# Altium schematic sheet CLK_buffer.SchDoc: Mordovia_MCH_CLK
size A4; Author: Filip Świtakowski; DrawnBy: Filip Świtakowski; DocumentNumber: 2; Revision: 1.0; SheetNumber: 2; SheetTotal: 4; ModifiedBy: -; CheckedDate: -; Title2: CLK_buffer; DivGrp: WUT ISE; Designer: Filip Świtakowski
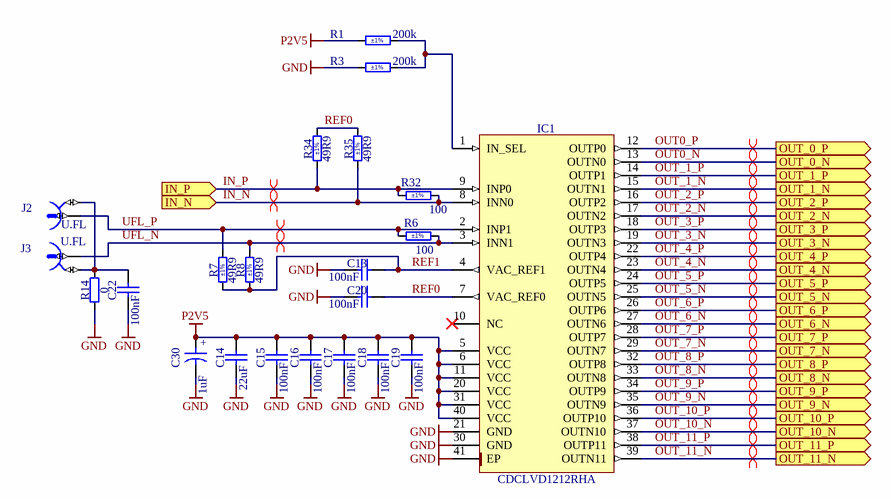
[diagram p0: CLK_buffer.SchDoc]

## Parts
C13  100nF  [CAPC1005X55N]
C14  22uF  [CAPC2012X135N]
C15  100nF  [CAPC1005X55N]
C16  100nF  [CAPC1005X55N]
C17  100nF  [CAPC1005X55N]
C18  100nF  [CAPC1005X55N]
C19  100nF  [CAPC1005X55N]
C20  100nF  [CAPC1005X55N]
C22  100nF  [CAPC1005X55N]
C30  1uF  [CAPMP3216X180N]
IC1  CDCLVD1212RHA  [QFN50P600X600X100-41N-S425]
J2  U.FL  [HIROSE_U.FL-R-SMT-1(10)]
J3  U.FL  [HIROSE_U.FL-R-SMT-1(10)]
R1  200k  Tolerance: ±1%  [RESC1005X40N]
R3  200k  Tolerance: ±1%  [RESC1005X40N]
R6  100  Tolerance: ±1%  [RESC1005X40N]
R7  49R9  Tolerance: ±1%  [RESC1005X40N]
R8  49R9  Tolerance: ±1%  [RESC1005X40N]
R14  0  [RESC1005X40N]
R32  100  Tolerance: ±1%  [RESC1005X40N]
R34  49R9  Tolerance: ±1%  [RESC1005X40N]
R35  49R9  Tolerance: ±1%  [RESC1005X40N]

## Ports
IN_N (in), IN_P (in), OUT_0_N (out), OUT_0_P (out), OUT_1_N (out), OUT_1_P (out), OUT_2_N (out), OUT_2_P (out), OUT_3_N (out), OUT_3_P (out), OUT_4_N (out), OUT_4_P (out), OUT_5_N (out), OUT_5_P (out), OUT_6_N (out), OUT_6_P (out), OUT_7_N (out), OUT_7_P (out), OUT_8_N (out), OUT_8_P (out), OUT_9_N (out), OUT_9_P (out), OUT_10_N (out), OUT_10_P (out), OUT_11_N (out), OUT_11_P (out)

## Nets
GND: C13.1 C14.1 C15.1 C16.1 C17.1 C18.1 C19.1 C20.1 C22.1 C30.2 IC1.21(GND) IC1.30(GND) IC1.41(EP) R3.1 R14.1
P2V5: C14.2 C15.2 C16.2 C17.2 C18.2 C19.2 C30.1 IC1.5(VCC) IC1.6(VCC) IC1.11(VCC) IC1.20(VCC) IC1.31(VCC) IC1.40(VCC) R1.1
IN_N: IC1.8(INN0) R32.2 R35.1 ; port IN_N
IN_P: IC1.9(INP0) R32.1 R34.1 ; port IN_P
OUT0_N: IC1.13(OUTN0) ; port OUT_0_N
OUT0_P: IC1.12(OUTP0) ; port OUT_0_P
OUT_1_N: IC1.15(OUTN1) ; port OUT_1_N
OUT_1_P: IC1.14(OUTP1) ; port OUT_1_P
OUT_2_N: IC1.17(OUTN2) ; port OUT_2_N
OUT_2_P: IC1.16(OUTP2) ; port OUT_2_P
OUT_3_N: IC1.19(OUTN3) ; port OUT_3_N
OUT_3_P: IC1.18(OUTP3) ; port OUT_3_P
OUT_~{4}_N: IC1.23(OUTN4) ; port OUT_4_N
OUT_4_P: IC1.22(OUTP4) ; port OUT_4_P
OUT_5_N: IC1.25(OUTN5) ; port OUT_5_N
OUT_5_P: IC1.24(OUTP5) ; port OUT_5_P
OUT_6_N: IC1.27(OUTN6) ; port OUT_6_N
OUT_6_P: IC1.26(OUTP6) ; port OUT_6_P
OUT_7_N: IC1.29(OUTN7) ; port OUT_7_N
OUT_7_P: IC1.28(OUTP7) ; port OUT_7_P
OUT_8_N: IC1.33(OUTN8) ; port OUT_8_N
OUT_8_P: IC1.32(OUTP8) ; port OUT_8_P
OUT_9_N: IC1.35(OUTN9) ; port OUT_9_N
OUT_9_P: IC1.34(OUTP9) ; port OUT_9_P
OUT_10_N: IC1.37(OUTN10) ; port OUT_10_N
OUT_10_P: IC1.36(OUTP10) ; port OUT_10_P
OUT_11_N: IC1.39(OUTN11) ; port OUT_11_N
OUT_11_P: IC1.38(OUTP11) ; port OUT_11_P
REF0: C20.2 IC1.7(VAC_REF0) R34.2 R35.2
REF1: C13.2 IC1.4(VAC_REF1) R7.1 R8.1
UFL_N: IC1.3(INN1) J3.1 R6.2 R8.2
UFL_P: IC1.2(INP1) J2.1 R6.1 R7.2
NetC22_2: C22.2 J2.2 J3.2 R14.2
NetIC1_1: IC1.1(IN_SEL) R1.2 R3.2

Not connected (* = marked no-connect by the designer): IC1 10(NC)*

## Layout directives
differential pair: IN_N, IN_P, OUT0_N, OUT0_P, OUT_1_N, OUT_1_P, OUT_2_N, OUT_2_P, OUT_3_N, OUT_3_P, OUT_4_P, OUT_5_N, OUT_5_P, OUT_6_N, OUT_6_P, OUT_7_N, OUT_7_P, OUT_8_N, OUT_8_P, OUT_9_N, OUT_9_P, OUT_10_N, OUT_10_P, OUT_11_N, OUT_11_P, OUT_~{4}_N, UFL_N, UFL_P

## Notes on the sheet
- Project/Equipment
- Document
- Designer
- Drawn by
- Check.by
- 01.20201
- PW ISE
- Contact
- File
- Last Mod.
- Print Date
- Sheet
- Size
- A4
- of
- Rev
- Copyright WUT ISE 2021.
  This documentation describes Open Hardware and is licensed under the CERN OHL v.1.2. You may redistribute and modify this documentation under the terms of the CERN OHL v.1.2. (http://ohwr.org/CERNOHL). This documentation is distributed WITHOUT ANY EXPRESS OR IMPLIED WARRANTY, INCLUDING OF MERCHANTABILITY, SATISFACTORY QUALITY AND FITNESS FOR A PARTICULAR PURPOSE. Please see the CERN OHL v.1.2 for applicable conditions.
- Nowowiejska 15/19 00-665 Warsaw
- (in symbol CTE3216-18_1UF_16V_10%) +

## Library data of the parts
C13 C15-C20 C22 = CC0402_100NF_50V_10%_X7R: Non-polarised capacitor; Part Description: SMD Multilayer Chip Ceramic Capacitor; Manufacturer: GENERIC; Manufacturer1 Part Number: GRM155R71H104KE14D; Voltage: 50V; TC: X7R; Tolerance: ±10%; Part Number: CC0402_100NF_50V_10%_X7R; Component Kind: Standard; Component Type: Standard; Pin Count: 2; Value: 100nF; Status: None; Manufacturer Part Number: CC0402_100NF_50V_10%_X7R; Case: 0402; Mounted: Yes; Socket: No; SMD: Yes; Sense: No; Manufacturer1 Example: MURATA; Manufacturer1 ComponentHeight: 0.55mm; HelpURL: \\cern.ch\dfs\Applications\Altium\Datasheets\CC0402_MURATA_GRM155R71H104KE14D.pdf; Author: CERN DEM MR; CreateDate: 30.06.2017; LatestRevisionDate: 30.06.2017
C14 = CC0805_22UF_16V_10%_X5R: Non-polarised capacitor; Part Description: SMD Multilayer Chip Ceramic Capacitor; Manufacturer: GENERIC; Manufacturer1 Part Number: C2012X5R1C226KT; Voltage: 16V; TC: X5R; Tolerance: ±10%; Part Number: CC0805_22UF_16V_10%_X5R; Component Kind: Standard; Component Type: Standard; Pin Count: 2; Value: 22uF; Status: Preferred; Manufacturer Part Number: CC0805_22UF_16V_10%_X5R; Case: 0805; Mounted: Yes; Socket: No; SMD: Yes; Sense: No; Manufacturer1 Example: TDK; Manufacturer1 ComponentHeight: 1.35mm; HelpURL: \\cern.ch\dfs\Applications\Altium\Datasheets\CC0805_X5R_TDK_C.pdf; Author: CERN DEM JLC; CreateDate: 25.10.2012; LatestRevisionDate: 25.10.2012
C30 = CTE3216-18_1UF_16V_10%: Polarised capacitor; Part Description: Solid Tantalum Chip Capacitor; Manufacturer: GENERIC; Manufacturer1 Part Number: TAJA105K016RNJ; Voltage: 16V; Tolerance: ±10%; Part Number: CTE3216-18_1UF_16V_10%; Component Kind: Standard; Component Type: Standard; Pin Count: 2; Value: 1uF; Status: Preferred; Manufacturer Part Number: CTE3216-18_1UF_16V_10%; Case: A; Mounted: Yes; Socket: No; SMD: Yes; Sense: No; Manufacturer1 Example: AVX; Manufacturer1 ComponentHeight: 1.8mm; HelpURL: \\cern.ch\dfs\Applications\Altium\Datasheets\CTE_AVX_TAJ.pdf; Author: CERN DEM JLC; CreateDate: 03.09.2012; LatestRevisionDate: 03.09.2012
IC1 = CDCLVD1212RHA: 2:12 Low Additive Jitter LVDS Buffer; Manufacturer: TEXAS INSTRUMENTS; PressFit: No; Bonding: No; Part Number: CDCLVD1212RHA; Component Kind: Standard; Component Type: Standard; Device: CDCLVD1212RHA; PackageDescription: QFN, 0.50mm Pitch, Square; 40 pin, 6.00mm L X 6.00mm W X 1.00mm H body (w/Thermal Tab 4.25 X 4.25mm), IPC Medium Density; Part Description: 2:12 Low Additive Jitter LVDS Buffer; Manufacturer Part Number: CDCLVD1212RHA; Pin Count: 41; Case: QFN40; Mounted: Yes; Socket: No; SMD: Yes; Sense: No; ComponentHeight: 1mm; HelpURL: \\cern.ch\dfs\Applications\Altium\Datasheets\CDCLVD1212RHA.pdf; Author: CERN DEM MR; CreateDate: 15.09.2017; LatestRevisionDate: 15.09.2017
J2 J3 = HIROSE_U.FL-R-SMT-1(10): Manufacturer: HIROSE (HRS); Part Description: Up to 6GHz Ultra Small Surface Mount Male Coaxial Connectors U.FL Series; PressFit: No; Manufacturer Part Number: U.FL-R-SMT-1(10); Part Number: HIROSE_U.FL-R-SMT-1(10); Component Kind: Standard; Component Type: Standard; Pin Count: 2; Family: U.FL; Mounted: Yes; Socket: No; SMD: Yes; Sense: No; Status: None; ComponentHeight: 1.25mm; HelpURL: \\cern.ch\dfs\Applications\Altium\Datasheets\HIROSE_U.FL-R-SMT-1(10).pdf; Author: CERN DEM JLC; CreateDate: 24.03.2010; LatestRevisionDate: 24.03.2010
R1 R3 = R0402_200K_1%_0.0625W_100PPM: Resistor - 1%; Part Description: General Purpose Thick Film Chip Resistor; Manufacturer: GENERIC; Manufacturer1 Part Number: 232270672004L; TC: ±100ppm/°C; PressFit: No; Part Number: R0402_200K_1%_0.0625W_100PPM; Component Kind: Standard; Component Type: Standard; Pin Count: 2; Value: 200k; Status: Not Recommended; Power: 0.0625W; Manufacturer Part Number: R0402_200K_1%_0.0625W_100PPM; Case: 0402; Mounted: Yes; Sense: No; Socket: No; SMD: Yes; Manufacturer1 Example: YAGEO PHYCOMP; Manufacturer1 ComponentHeight: 0.4mm; HelpURL: \\cern.ch\dfs\Applications\Altium\Datasheets\R0402_Phycomp_RC0402.pdf; Author: CERN DEM JLC; CreateDate: 03.12.2007; LatestRevisionDate: 17.10.2012
R6 R32 = R0402_100R_1%_0.0625W_100PPM: Resistor - 1%; Part Description: General Purpose Thick Film Chip Resistor; Manufacturer: GENERIC; Manufacturer1 Part Number: 232270671001L; TC: ±100ppm/°C; PressFit: No; Part Number: R0402_100R_1%_0.0625W_100PPM; Component Kind: Standard; Component Type: Standard; Pin Count: 2; Value: 100; Status: Not Recommended; Power: 0.0625W; Manufacturer Part Number: R0402_100R_1%_0.0625W_100PPM; Case: 0402; Mounted: Yes; Sense: No; Socket: No; SMD: Yes; Manufacturer1 Example: YAGEO PHYCOMP; Manufacturer1 ComponentHeight: 0.4mm; HelpURL: \\cern.ch\dfs\Applications\Altium\Datasheets\R0402_Phycomp_RC0402.pdf; Author: CERN DEM JLC; CreateDate: 03.12.2007; LatestRevisionDate: 17.10.2012
R7 R8 R34 R35 = R0402_49R9_1%_0.0625W_100PPM: Resistor - 1%; Part Description: General Purpose Thick Film Chip Resistor; Manufacturer: GENERIC; Manufacturer1 Part Number: 232270674999L or RC0402FR-0749R9L; TC: ±100ppm/°C; PressFit: No; Part Number: R0402_49R9_1%_0.0625W_100PPM; Component Kind: Standard; Component Type: Standard; Pin Count: 2; Value: 49R9; Status: Not Recommended; Power: 0.0625W; Manufacturer Part Number: R0402_49R9_1%_0.0625W_100PPM; Case: 0402; Mounted: Yes; Sense: No; Socket: No; SMD: Yes; Manufacturer1 Example: YAGEO PHYCOMP; Manufacturer1 ComponentHeight: 0.4mm; HelpURL: \\cern.ch\dfs\Applications\Altium\Datasheets\R0402_Phycomp_RC0402.pdf; Author: CERN DEM JLC; CreateDate: 24.10.2012; LatestRevisionDate: 24.10.2012
R14 = R0402_0R_JUMPER: Resistor; Manufacturer: GENERIC; Part Description: 1A (0.05R Max DC Resistance) Zero Ohm Jumper; Manufacturer1 Part Number: 232270591001L; PressFit: No; Manufacturer Part Number: R0402_0R_JUMPER; Part Number: R0402_0R_JUMPER; Value: 0; Component Kind: Standard; Component Type: Standard; Pin Count: 2; Status: Not Recommended; Case: 0402; Mounted: Yes; Sense: No; Socket: No; SMD: Yes; Manufacturer1 Example: YAGEO PHYCOMP; Manufacturer1 ComponentHeight: 0.4mm; HelpURL: \\cern.ch\dfs\Applications\Altium\Datasheets\R0402_Phycomp_RC0402.pdf; Author: CERN DEM JLC; CreateDate: 03.12.2007; LatestRevisionDate: 17.10.2012